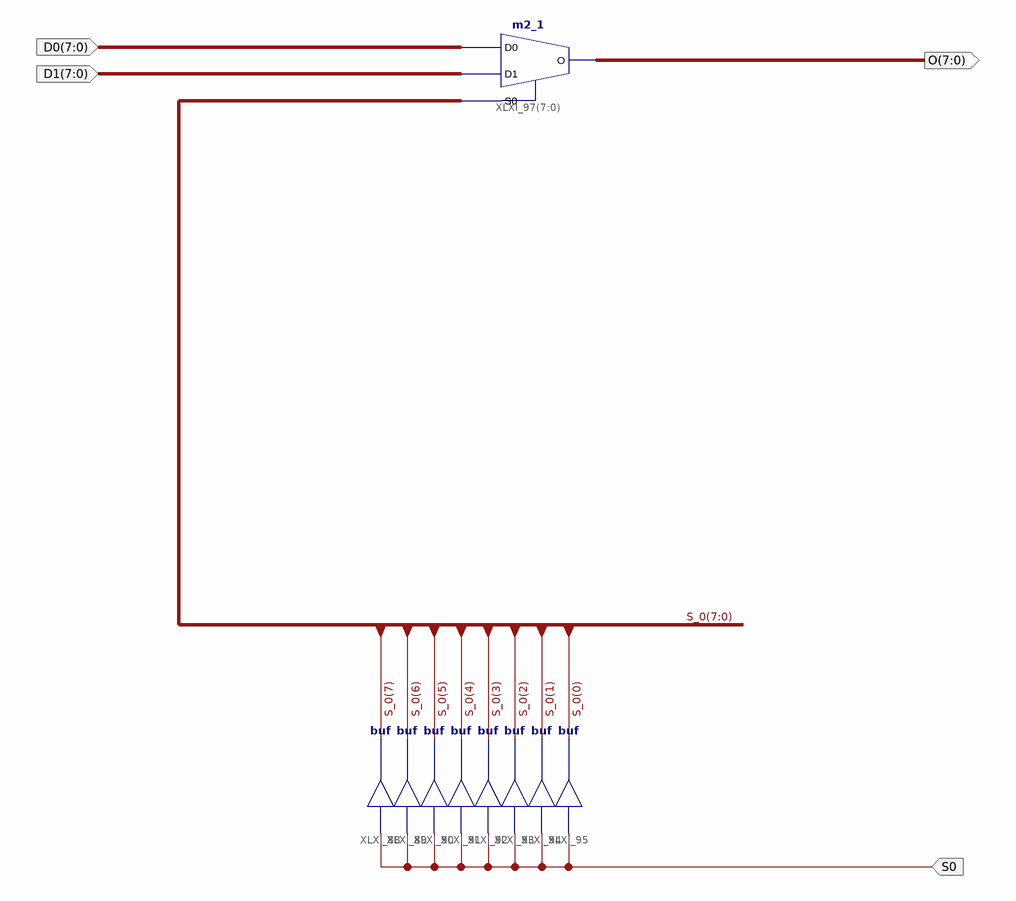
[diagram p0: schematic sheet 1]
// Xilinx ISE schematic m2_1_8bit.sch (spartan3e) as structural Verilog: 9 symbols, 4 ports
module m2_1_8bit (
  input  S0,
  input  [7:0] D0,
  input  [7:0] D1,
  output [7:0] O
);

  wire [7:0] S_0;

  buf XLXI_88 (S_0[7], S0);
  buf XLXI_89 (S_0[6], S0);
  buf XLXI_90 (S_0[5], S0);
  buf XLXI_91 (S_0[4], S0);
  buf XLXI_92 (S_0[3], S0);
  buf XLXI_93 (S_0[2], S0);
  buf XLXI_94 (S_0[1], S0);
  buf XLXI_95 (S_0[0], S0);
  m2_1 XLXI_97[7:0] (.D0(D0), .D1(D1), .S0(S_0), .O(O));
endmodule
